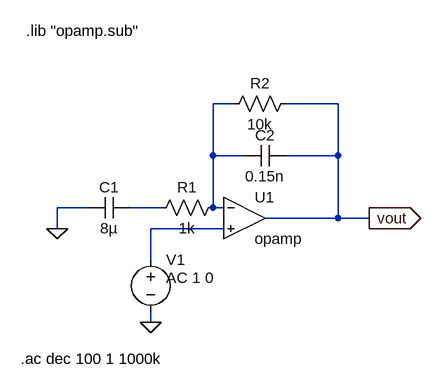
[diagram p0: schematic kadai2-3.asc]
kadai2-3.asc, the LTspice schematic file:
Version 4
SHEET 1 880 680
WIRE 448 -96 416 -96
WIRE 608 -96 528 -96
WIRE 416 -16 416 -96
WIRE 464 -16 416 -16
WIRE 608 -16 608 -96
WIRE 608 -16 528 -16
WIRE 224 64 176 64
WIRE 336 64 288 64
WIRE 416 64 416 -16
WIRE 432 64 416 64
WIRE 608 80 608 -16
WIRE 608 80 496 80
WIRE 656 80 608 80
WIRE 176 96 176 64
WIRE 432 96 320 96
WIRE 320 144 320 96
WIRE 320 240 320 224
FLAG 176 96 0
FLAG 320 240 0
FLAG 656 80 vout
IOPIN 656 80 Out
SYMBOL OpAmps\\opamp 464 16 R0
SYMATTR InstName U1
SYMBOL res 432 48 R90
WINDOW 0 0 56 VBottom 2
WINDOW 3 32 56 VTop 2
SYMATTR InstName R1
SYMATTR Value 1k
SYMBOL cap 528 -32 R90
WINDOW 0 0 32 VBottom 2
WINDOW 3 32 32 VTop 2
SYMATTR InstName C2
SYMATTR Value 0.15n
SYMBOL voltage 320 128 R0
WINDOW 123 24 44 Left 2
WINDOW 39 0 0 Left 0
SYMATTR InstName V1
SYMATTR Value ""
SYMATTR Value2 AC 1 0
SYMBOL res 544 -112 R90
WINDOW 0 0 56 VBottom 2
WINDOW 3 32 56 VTop 2
SYMATTR InstName R2
SYMATTR Value 10k
SYMBOL cap 288 48 R90
WINDOW 0 0 32 VBottom 2
WINDOW 3 32 32 VTop 2
SYMATTR InstName C1
SYMATTR Value 8µ
TEXT 128 -208 Left 2 !.lib "opamp.sub"
TEXT 120 296 Left 2 !.ac dec 100 1 1000k

The netlist it stands for:
* kadai2-3.asc
XU1 N001 N003 vout opamp Aol=100K GBW=10Meg  ; pins invin noninvin out
R1 N001 N002 1k
C2 vout N001 0.15n
V1 N003 0 AC 1 0
R2 vout N001 10k
C1 N002 0 8µ
.lib "opamp.sub"
.ac dec 100 1 1000k
.backanno
.end